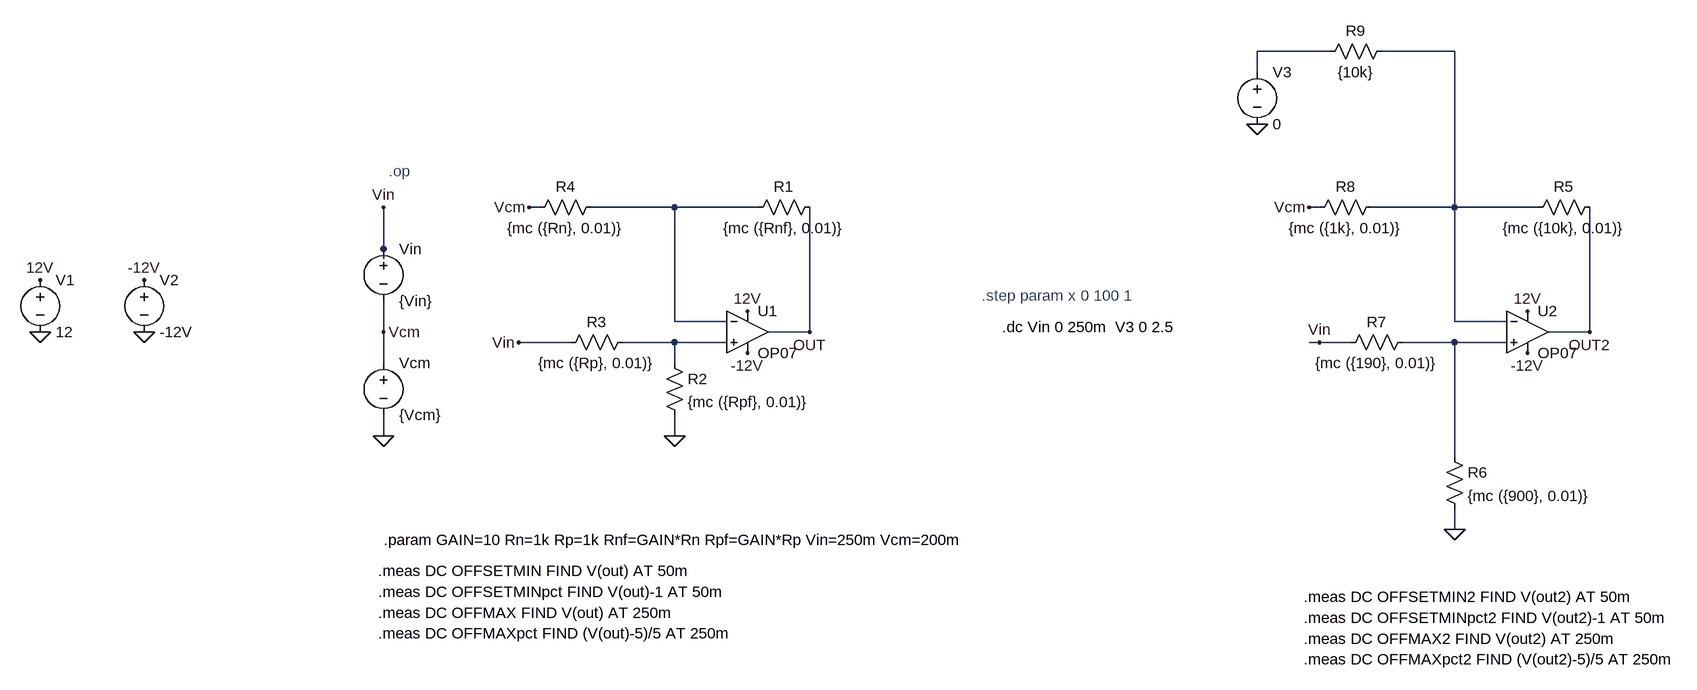
[diagram p0: schematic differential amp.asc]
differential amp.asc, the LTspice schematic file:
Version 4
SHEET 1 3676 2772
WIRE 2480 -784 2368 -784
WIRE 2672 -784 2560 -784
WIRE 2368 -752 2368 -784
WIRE 1264 -544 1248 -544
WIRE 1472 -544 1344 -544
WIRE 1600 -544 1472 -544
WIRE 2464 -544 2448 -544
WIRE 2672 -544 2672 -784
WIRE 2672 -544 2544 -544
WIRE 2800 -544 2672 -544
WIRE 1024 -480 1024 -544
WIRE 1024 -464 1024 -480
WIRE 1472 -368 1472 -544
WIRE 1552 -368 1472 -368
WIRE 2672 -368 2672 -544
WIRE 2752 -368 2672 -368
WIRE 1024 -352 1024 -400
WIRE 1680 -352 1680 -544
WIRE 1680 -352 1616 -352
WIRE 2880 -352 2880 -544
WIRE 2880 -352 2816 -352
WIRE 1312 -336 1232 -336
WIRE 1472 -336 1392 -336
WIRE 1552 -336 1472 -336
WIRE 2464 -336 2448 -336
WIRE 2512 -336 2464 -336
WIRE 2672 -336 2592 -336
WIRE 2752 -336 2672 -336
WIRE 1024 -304 1024 -352
WIRE 1472 -304 1472 -336
WIRE 1024 -192 1024 -224
WIRE 1472 -192 1472 -224
WIRE 2672 -160 2672 -336
WIRE 2672 -48 2672 -80
FLAG 496 -352 0
FLAG 1584 -384 12V
FLAG 496 -432 12V
FLAG 656 -352 0
FLAG 656 -432 -12V
FLAG 1584 -320 -12V
FLAG 1472 -192 0
FLAG 1024 -192 0
FLAG 1680 -352 OUT
FLAG 2784 -384 12V
FLAG 2784 -320 -12V
FLAG 2672 -48 0
FLAG 2880 -352 OUT2
FLAG 1024 -544 Vin
FLAG 1024 -352 Vcm
FLAG 1248 -544 Vcm
FLAG 2448 -544 Vcm
FLAG 1232 -336 Vin
FLAG 2464 -336 Vin
FLAG 2368 -672 0
SYMBOL OpAmps\\OP07 1584 -416 R0
SYMATTR InstName U1
SYMBOL voltage 496 -448 R0
WINDOW 123 0 0 Left 0
WINDOW 39 0 0 Left 0
SYMATTR InstName V1
SYMATTR Value 12
SYMBOL voltage 656 -448 R0
WINDOW 123 0 0 Left 0
WINDOW 39 0 0 Left 0
SYMATTR InstName V2
SYMATTR Value -12V
SYMBOL res 1696 -560 R90
WINDOW 0 0 56 VBottom 2
WINDOW 3 32 56 VTop 2
SYMATTR InstName R1
SYMATTR Value {mc ({Rnf}, 0.01)}
SYMBOL res 1456 -320 R0
SYMATTR InstName R2
SYMATTR Value {mc ({Rpf}, 0.01)}
SYMBOL res 1408 -352 R90
WINDOW 0 0 56 VBottom 2
WINDOW 3 32 56 VTop 2
SYMATTR InstName R3
SYMATTR Value {mc ({Rp}, 0.01)}
SYMBOL res 1360 -560 R90
WINDOW 0 0 56 VBottom 2
WINDOW 3 32 56 VTop 2
SYMATTR InstName R4
SYMATTR Value {mc ({Rn}, 0.01)}
SYMBOL voltage 1024 -496 R0
WINDOW 123 0 0 Left 0
WINDOW 39 0 0 Left 0
SYMATTR InstName Vin
SYMATTR Value {Vin}
SYMBOL voltage 1024 -320 R0
WINDOW 123 0 0 Left 0
WINDOW 39 0 0 Left 0
SYMATTR InstName Vcm
SYMATTR Value {Vcm}
SYMBOL OpAmps\\OP07 2784 -416 R0
SYMATTR InstName U2
SYMBOL res 2896 -560 R90
WINDOW 0 0 56 VBottom 2
WINDOW 3 32 56 VTop 2
SYMATTR InstName R5
SYMATTR Value {mc ({10k}, 0.01)}
SYMBOL res 2656 -176 R0
SYMATTR InstName R6
SYMATTR Value {mc ({900}, 0.01)}
SYMBOL res 2608 -352 R90
WINDOW 0 0 56 VBottom 2
WINDOW 3 32 56 VTop 2
SYMATTR InstName R7
SYMATTR Value {mc ({190}, 0.01)}
SYMBOL res 2560 -560 R90
WINDOW 0 0 56 VBottom 2
WINDOW 3 32 56 VTop 2
SYMATTR InstName R8
SYMATTR Value {mc ({1k}, 0.01)}
SYMBOL res 2576 -800 R90
WINDOW 0 0 56 VBottom 2
WINDOW 3 32 56 VTop 2
SYMATTR InstName R9
SYMATTR Value {10k}
SYMBOL voltage 2368 -768 R0
WINDOW 123 0 0 Left 0
WINDOW 39 0 0 Left 0
SYMATTR InstName V3
SYMATTR Value 0
TEXT 1024 -32 Left 2 !.param GAIN=10 Rn=1k Rp=1k Rnf=GAIN*Rn Rpf=GAIN*Rp Vin=250m Vcm=200m
TEXT 1976 -360 Left 2 !.dc Vin 0 250m  V3 0 2.5
TEXT 1016 16 Left 2 !.meas DC OFFSETMIN FIND V(out) AT 50m
TEXT 1016 80 Left 2 !.meas DC OFFMAX FIND V(out) AT 250m
TEXT 1032 -600 Left 2 ;.op
TEXT 1016 112 Left 2 !.meas DC OFFMAXpct FIND (V(out)-5)/5 AT 250m
TEXT 1944 -408 Left 2 ;.step param x 0 100 1
TEXT 1016 48 Left 2 !.meas DC OFFSETMINpct FIND V(out)-1 AT 50m
TEXT 2440 56 Left 2 !.meas DC OFFSETMIN2 FIND V(out2) AT 50m
TEXT 2440 120 Left 2 !.meas DC OFFMAX2 FIND V(out2) AT 250m
TEXT 2440 152 Left 2 !.meas DC OFFMAXpct2 FIND (V(out2)-5)/5 AT 250m
TEXT 2440 88 Left 2 !.meas DC OFFSETMINpct2 FIND V(out2)-1 AT 50m

The netlist it stands for:
* differential amp.asc
XU1 N004 N003 12V -12V OUT LT1001  ; OP07, pins In+ In- V+ V- OUT
V1 12V 0 12
V2 -12V 0 -12V
R1 OUT N003 {mc ({Rnf}, 0.01)}
R2 N004 0 {mc ({Rpf}, 0.01)}
R3 N004 Vin {mc ({Rp}, 0.01)}
R4 N003 Vcm {mc ({Rn}, 0.01)}
Vin Vin Vcm {Vin}
Vcm Vcm 0 {Vcm}
XU2 N005 N002 12V -12V OUT2 LT1001  ; OP07, pins In+ In- V+ V- OUT
R5 OUT2 N002 {mc ({10k}, 0.01)}
R6 N005 0 {mc ({900}, 0.01)}
R7 N005 Vin {mc ({190}, 0.01)}
R8 N002 Vcm {mc ({1k}, 0.01)}
R9 N002 N001 {10k}
V3 N001 0 0
.param GAIN=10 Rn=1k Rp=1k Rnf=GAIN*Rn Rpf=GAIN*Rp Vin=250m Vcm=200m
.dc Vin 0 250m  V3 0 2.5
.meas DC OFFSETMIN FIND V(out) AT 50m
.meas DC OFFMAX FIND V(out) AT 250m
* .op
.meas DC OFFMAXpct FIND (V(out)-5)/5 AT 250m
* .step param x 0 100 1
.meas DC OFFSETMINpct FIND V(out)-1 AT 50m
.meas DC OFFSETMIN2 FIND V(out2) AT 50m
.meas DC OFFMAX2 FIND V(out2) AT 250m
.meas DC OFFMAXpct2 FIND (V(out2)-5)/5 AT 250m
.meas DC OFFSETMINpct2 FIND V(out2)-1 AT 50m
.lib LTC.lib
.backanno
.end